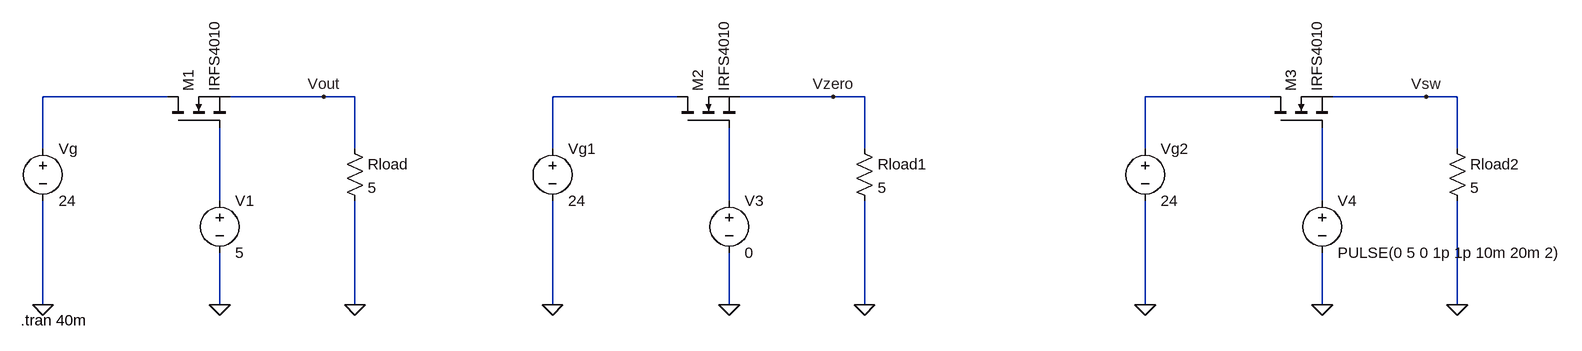
[diagram p0: schematic MOSFET_Switch.asc]
MOSFET_Switch.asc, the LTspice schematic file:
Version 4
SHEET 1 2708 680
WIRE 528 -336 336 -336
WIRE 768 -336 624 -336
WIRE 816 -336 768 -336
WIRE 1312 -336 1120 -336
WIRE 1552 -336 1408 -336
WIRE 1600 -336 1552 -336
WIRE 2224 -336 2032 -336
WIRE 2464 -336 2320 -336
WIRE 2512 -336 2464 -336
WIRE 336 -256 336 -336
WIRE 816 -256 816 -336
WIRE 1120 -256 1120 -336
WIRE 1600 -256 1600 -336
WIRE 2032 -256 2032 -336
WIRE 2512 -256 2512 -336
WIRE 608 -176 608 -288
WIRE 1392 -176 1392 -288
WIRE 2304 -176 2304 -288
WIRE 336 -16 336 -176
WIRE 608 -16 608 -96
WIRE 816 -16 816 -176
WIRE 1120 -16 1120 -176
WIRE 1392 -16 1392 -96
WIRE 1600 -16 1600 -176
WIRE 2032 -16 2032 -176
WIRE 2304 -16 2304 -96
WIRE 2512 -16 2512 -176
FLAG 336 -16 0
FLAG 768 -336 Vout
FLAG 816 -16 0
FLAG 608 -16 0
FLAG 1120 -16 0
FLAG 1552 -336 Vzero
FLAG 1600 -16 0
FLAG 1392 -16 0
FLAG 2032 -16 0
FLAG 2464 -336 Vsw
FLAG 2512 -16 0
FLAG 2304 -16 0
SYMBOL nmos 528 -288 R270
SYMATTR InstName M1
SYMATTR Value IRFS4010
SYMBOL res 800 -272 R0
SYMATTR InstName Rload
SYMATTR Value 5
SYMBOL voltage 336 -272 R0
SYMATTR InstName Vg
SYMATTR Value 24
SYMBOL voltage 608 -192 R0
WINDOW 123 0 0 Left 0
WINDOW 39 0 0 Left 0
SYMATTR InstName V1
SYMATTR Value 5
SYMBOL nmos 1312 -288 R270
SYMATTR InstName M2
SYMATTR Value IRFS4010
SYMBOL res 1584 -272 R0
SYMATTR InstName Rload1
SYMATTR Value 5
SYMBOL voltage 1120 -272 R0
SYMATTR InstName Vg1
SYMATTR Value 24
SYMBOL voltage 1392 -192 R0
WINDOW 123 0 0 Left 0
WINDOW 39 0 0 Left 0
SYMATTR InstName V3
SYMATTR Value 0
SYMBOL nmos 2224 -288 R270
SYMATTR InstName M3
SYMATTR Value IRFS4010
SYMBOL res 2496 -272 R0
SYMATTR InstName Rload2
SYMATTR Value 5
SYMBOL voltage 2032 -272 R0
SYMATTR InstName Vg2
SYMATTR Value 24
SYMBOL voltage 2304 -192 R0
WINDOW 123 0 0 Left 0
WINDOW 39 0 0 Left 0
SYMATTR InstName V4
SYMATTR Value PULSE(0 5 0 1p 1p 10m 20m 2)
TEXT 302 8 Left 2 !.tran 40m

The netlist it stands for:
* MOSFET_Switch.asc
M1 N001 N004 Vout Vout IRFS4010
Rload Vout 0 5
Vg N001 0 24
V1 N004 0 5
M2 N002 N005 Vzero Vzero IRFS4010
Rload1 Vzero 0 5
Vg1 N002 0 24
V3 N005 0 0
M3 N003 N006 Vsw Vsw IRFS4010
Rload2 Vsw 0 5
Vg2 N003 0 24
V4 N006 0 PULSE(0 5 0 1p 1p 10m 20m 2)
.model NMOS NMOS
.model PMOS PMOS
.lib standard.mos
.tran 40m
.backanno
.end